# EAGLE schematic heartEM (EAGLE 9.6.2)
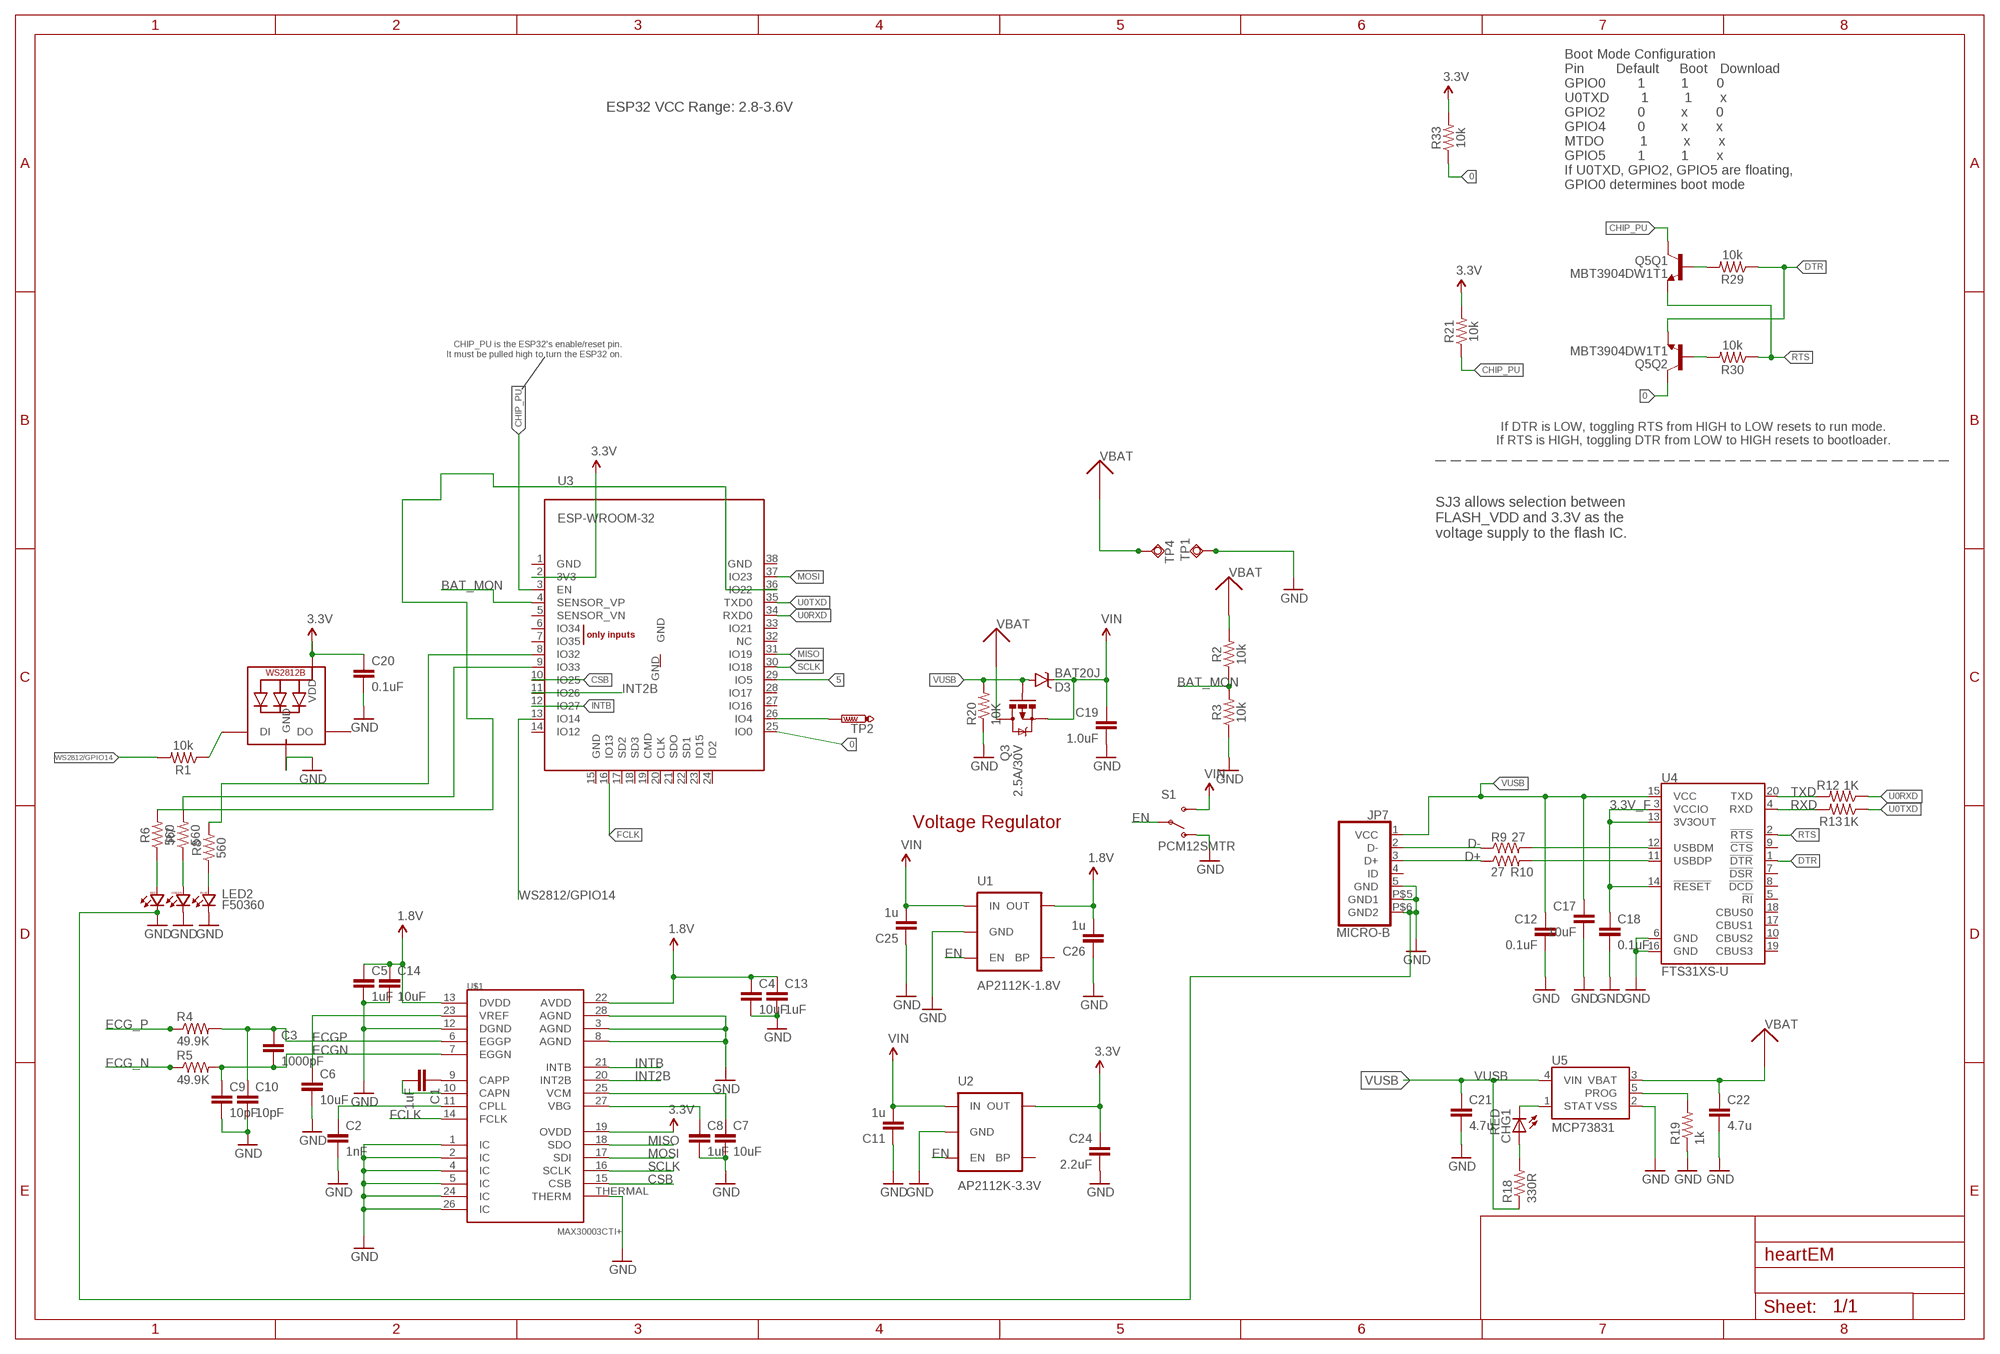
[diagram p0: schematic, sheet 1]

## Parts
C1  1uF  C-EUC0603  [C0603]
C2  1nF  C-EUC0603  [C0603]
C3  1000pF  C-EUC0402  [C0402]
C4  10uF  C-EUC0805  [C0805]
C5  1uF  C-EUC0402  [C0402]
C6  10uF  C-EUC0805  [C0805]
C7  10uF  C-EUC0805  [C0805]
C8  1uF  C-EUC0805  [C0805]
C9  10pF  C-EUC0402  [C0402]
C10  10pF  C-EUC0402  [C0402]
C11  1u  C-EUC0402  [C0402]
C12  0.1uF  C-EUC0402  [C0402]
C13  1uF  C-EUC0805  [C0805]
C14  10uF  C-EUC0603  [C0603]
C17  10uF  C-EUC0805  [C0805]
C18  0.1uF  C-EUC0402  [C0402]
C19  1.0uF  C-EUC0402  [C0402]
C20  0.1uF  0.1UF-0603-25V-(+80/-20%)  [0603]
C21  4.7u  C-EUC0805  [C0805]
C22  4.7u  C-EUC0805  [C0805]
C24  2.2uF  C-EUC0603  [C0603]
C25  1u  C-EUC0402  [C0402]
C26  1u  C-EUC0402  [C0402]
CHG1  RED  LEDCHIPLED_0603  [CHIPLED_0603]
D3  BAT20J  DIODE-SCHOTTKY-BAT20J  [SOD-323]
JP7  MICRO-B  [MICRO-B]
LED1  WS2812B5050  [WS2812B]
LED2  F50360  [F50360]
Q3  2.5A/30V  MOSFET-PCHANNELDMG2307L  [SOT23-3]
Q5  MBT3904DW1T1  [SC70-6]
R1  10k  10KOHM-1/10W-1%(0603)0603  [0603]
R2  10k  10KOHM-1/10W-1%(0603)0603  [0603]
R3  10k  10KOHM-1/10W-1%(0603)0603  [0603]
R4  49.9K  RESISTOR0805-RES  [0805]
R5  49.9K  RESISTOR0805-RES  [0805]
R6  560  10KOHM-1/10W-1%(0603)0603  [0603]
R7  560  10KOHM-1/10W-1%(0603)0603  [0603]
R8  560  10KOHM-1/10W-1%(0603)0603  [0603]
R9  27  R-US_R0402  [R0402]
R10  27  R-US_R0402  [R0402]
R12  1K  R-US_R0402  [R0402]
R13  1K  R-US_R0402  [R0402]
R18  330R  R-US_R0402  [R0402]
R19  1k  R-US_R0402  [R0402]
R20  10K  R-US_R0402  [R0402]
R21  10k  10KOHM-1/10W-1%(0603)0603  [0603]
R29  10k  10KOHM-0603-1/10W-1%  [0603]
R30  10k  10KOHM-0603-1/10W-1%  [0603]
R33  10k  10KOHM-1/10W-1%(0603)0603  [0603]
S1  PCM12SMTR  SWITCH-SPDT-SMD-A  [SWITCH-SPST-SMD-A]
TP1  TPSQTP20SQ  [TP20SQ]
TP2  PTR1TP10SQ  [TP10SQ]
TP4  TPSQTP20SQ  [TP20SQ]
U1  AP2112K-1.8V  V_REG_LDOSMD  [SOT23-5]
U2  AP2112K-3.3V  V_REG_LDOSMD  [SOT23-5]
U3  ESP-WROOM-32  [ESP-WROOM-32]
U4  FTS31XS-U  FT231XS  [SSOP20_L]
U5  MCP73831  [SOT23-5]
U$1  MAX30003CTI+  MAX30003  [QFN-28]

## Nets
0: Q5.6(Q2:C) R33.1 U3.25(IO0)
1.8V: C4.1 C5.1 C13.1 C14.1 C26.2 U1.5(OUT) U$1.13(DVDD) U$1.22(AVDD)
3.3V: C20.1 C24.1 LED1.1-VDD(VDD) R21.2 R33.2 U2.5(OUT) U3.2(3V3) U$1.19(OVDD)
3.3V_F: C18.1 U4.3(VCCIO) U4.13(3V3OUT) U4.14(!RESET)
5: U3.29(IO5)
BAT_MON: R2.1 R3.2 U3.4(SENSOR_VP)
CHIP_PU: Q5.3(Q1:C) R21.1 U3.3(EN)
CSB: U3.10(IO25) U$1.15(CSB)
D+: JP7.3(D+) R10.1
D-: JP7.2(D-) R9.1
DTR: Q5.1(Q2:E) R29.1 U4.1(!DTR)
ECG_N: R5.1
ECG_P: R4.1
ECGN: C3.2 C9.1 R5.2 U$1.7(EGGN)
ECGP: C3.1 C10.1 R4.2 U$1.6(EGGP)
EN: S1.2(P) U1.3(EN) U2.3(EN)
FCLK: U3.16(IO13) U$1.14(FCLK)
GND: C2.2 C4.2 C5.2 C6.2 C7.2 C8.2 C9.2 C10.2 C11.1 C12.2 C13.2 C14.2 C17.2 C18.2 C19.2 C20.2 C21.2 C22.2 C24.2 C25.1 C26.1 JP7.5(GND) JP7.P$5(GND1) JP7.P$6(GND2) LED1.3-GND(GND) LED2.BC LED2.GC LED2.RC R3.1 R19.1 R20.1 S1.1(O) TP1.TP U1.2(GND) U2.2(GND) U4.6(GND) U4.16(GND) U5.2(VSS) U$1.1(IC) U$1.2(IC) U$1.3(AGND) U$1.4(IC) U$1.5(IC) U$1.8(AGND) U$1.12(DGND) U$1.24(IC) U$1.26(IC) U$1.28(AGND) U$1.THERMAL(THERM)
INT2B: U3.11(IO26) U$1.20(INT2B)
INTB: U3.12(IO27) U$1.21(INTB)
MISO: U3.31(IO19) U$1.18(SDO)
MOSI: U3.37(IO23) U$1.17(SDI)
N$1: LED1.4-DIN(DI) R1.1
N$2: C6.1 U$1.23(VREF)
N$3: C1.1 U$1.9(CAPP)
N$4: TP2.TP U3.26(IO4)
N$5: CHG1.C U5.1(STAT)
N$6: C1.2 U$1.10(CAPN)
N$7: C2.1 U$1.11(CPLL)
N$9: R9.2 U4.12(USBDM)
N$10: LED2.RA R6.1
N$11: R10.2 U4.11(USBDP)
N$12: R7.2 U3.9(IO33)
N$13: C7.1 U$1.25(VCM)
N$14: C8.1 U$1.27(VBG)
N$15: LED2.BA R8.1
N$16: CHG1.A R18.2
N$17: LED2.GA R7.1
N$19: R19.2 U5.5(PROG)
N$20: R8.2 U3.8(IO32)
N$22: R6.2 U3.36(IO22)
N$23: Q5.5(Q1:B) R29.2
N$24: Q5.2(Q2:B) R30.2
RTS: Q5.4(Q1:E) R30.1 U4.2(!RTS)
RXD: R13.2 U4.4(RXD)
SCLK: U3.30(IO18) U$1.16(SCLK)
TXD: R12.2 U4.20(TXD)
U0RXD: R12.1 U3.34(RXD0)
U0TXD: R13.1 U3.35(TXD0)
VBAT: C22.1 Q3.3(D) R2.2 TP4.TP U5.3(VBAT)
VIN: C11.2 C19.1 C25.2 D3.C Q3.2(S) S1.3(S) U1.1(IN) U2.1(IN)
VUSB: C12.1 C17.1 C21.1 D3.A JP7.1(VCC) Q3.1(G) R18.1 R20.2 U4.15(VCC) U5.4(VIN)
WS2812/GPIO14: R1.2 U3.13(IO14)
Unconnected: JP7.4(ID) LED1.2-DOUT(DO) U1.4(BP) U2.4(BP) U3.1(GND) U3.5(SENSOR_VN) U3.6(IO34) U3.7(IO35) U3.14(IO12) U3.15(GND) U3.17(SD2) U3.18(SD3) U3.19(CMD) U3.20(CLK) U3.21(SDO) U3.22(SD1) U3.23(IO15) U3.24(IO2) U3.27(IO16) U3.28(IO17) U3.32(NC) U3.33(IO21) U3.38(GND) U3.GND U4.5(!RI) U4.7(!DSR) U4.8(!DCD) U4.9(!CTS) U4.10(CBUS2) U4.17(CBUS1) U4.18(CBUS0) U4.19(CBUS3)

## Notes on the sheet
- ESP32 VCC Range: 2.8-3.6V
- Boot Mode Configuration
  Pin        Default     Boot   Download
  GPIO0        1         1       0
  U0TXD        1         1       x
  GPIO2        0         x       0
  GPIO4        0         x       x
  MTDO         1         x       x
  GPIO5        1         1       x
  If U0TXD, GPIO2, GPIO5 are floating, 
  GPIO0 determines boot mode
- CHIP_PU is the ESP32's enable/reset pin.
  It must be pulled high to turn the ESP32 on.
- If DTR is LOW, toggling RTS from HIGH to LOW resets to run mode.
  If RTS is HIGH, toggling DTR from LOW to HIGH resets to bootloader.
- SJ3 allows selection between 
  FLASH_VDD and 3.3V as the
  voltage supply to the flash IC.
- Voltage Regulator

## Library data of the parts
C1-C14 C17-C19 C21 C22 C24-C26 = rcl:C-EU: CAPACITOR, European symbol; SPICEPREFIX: C
C20 = SparkFun-Capacitors:0.1UF: 0.1µF ceramic capacitors A capacitor is a passive two-terminal electrical component used to store electrical energy temporarily in an electric field.; PROD_ID: CAP-00810
CHG1 = led:LED: LED OSRAM: - CHIPLED LG R971, LG N971, LY N971, LG Q971, LY Q971, LO R971, LY R971 LH N974, LH R974 LS Q976, LO Q976, LY Q976 LO Q996 - Hyper CHIPLED LW Q18S LB Q993, LB Q99A, LB R99A - SideLED LS A670, LO A670, LY A670, LG A670, LP A670 LB A673, LV A673, LT A673, LW A673 LH A674 LY A675 LS A676, LA A676, LO A676, LY A676, LW A676 LS A679, LY A679, LG A679 - Hyper Micro SIDELED® LS Y876, LA Y876, LO Y876, LY Y876 LT Y87S - SmartLED LW L88C, LW L88S LB L89C, LB L89S, LG L890 LS L89K, LO L89K, LY L89K LS L896, LA L896, LO L896, LY L896 - TOPLED LS T670, LO T670, LY T670, LG T670, LP T670 LSG T670, LSP T670, LSY T670, LOP T670, LYG T670 LG T671, LOG T671, LSG T671 LB T673, LV T673, LT T673, LW T673 LH T674 LS T676, LA T676, LO T676, LY T676, LB T676, LH T676, LSB T676, LW T676 LB T67C, LV T67C, LT T67C, LS T67K, LO T67K, LY T67K, LW E67C LS E67B, LA E67B, LO E67B, LY E67B, LB E67C, LV E67C, LT E67C LW T67C LS T679, LY T679, LG T679 LS T770, LO T770, LY T770, LG T770, LP T770 LB T773, LV T773, LT T773, LW T773 LH T774 LS E675, LA E675, LY E675, LS T675 LS T776, LA T776, LO T776, LY T776, LB T776 LHGB T686 LT T68C, LB T68C - Hyper Mini TOPLED® LB M676 - Mini TOPLED Santana® LG M470 LS M47K, LO M47K, LY M47K Source: http://www.osram.convergy.de LUXEON: - LUMILED® LXK2-PW12-R00, LXK2-PW12-S00, LXK2-PW14-U00, LXK2-PW14-V00 LXK2-PM12-R00, LXK2-PM12-S00, LXK2-PM14-U00 LXK2-PE12-Q00, LXK2-PE12-R00, LXK2-PE12-S00, LXK2-PE14-T00, LXK2-PE14-U00 LXK2-PB12-K00, LXK2-PB12-L00, LXK2-PB12-M00, LXK2-PB14-N00, LXK2-PB14-P00, LXK2-PB14-Q00 LXK2-PR12-L00, LXK2-PR12-M00, LXK2-PR14-Q00, LXK2-PR14-R00 LXK2-PD12-Q00, LXK2-PD12-R00, LXK2-PD12-S00 LXK2-PH12-R00, LXK2-PH12-S00 LXK2-PL12-P00, LXK2-PL12-Q00, LXK2-PL12-R00 Source: www.luxeon.com KINGBRIGHT: KA-3528ASYC Source: www.kingbright.com
D3 = SparkFun-DiscreteSemi:DIODE-SCHOTTKY: Schottky diodes in SFE's production catalog BAT20J 1A 23V 0.62Vf RB751 120mA 40V 0.37Vf PMEG4005EJ 0.5A 40V 0.42Vf MBRA140 1A 40V 0.5Vf B340A 3A 40V SMA; PROD_ID: DIO-11623
JP7 = circuitects:MICRO-B
LED1 = adafruit:WS2812B
LED2 = led:F50360: Full color Z-Power LED RGB P5-II Series Source: http://www.seoulsemicon.co.kr .. F50360.pdf
Q3 = SparkFun-DiscreteSemi:MOSFET-PCHANNEL: Generic PMOSFET IRLML2244 - TRANS-11153 (SOT-23 -20V -4.3A) (1.Gate 2.Source 3.Drain) FQP27P06 - COM-10349 <http://www.sparkfun.com/products/10349> (TO-220 -60V -27A) (1.Gate 2.Source 3.Drain); PROD_ID: TRANS-11308
Q5 = esp32-thing-temp:MBT3904DW1T1: MBT3904DW1 Dual NPN Transistors The MBT3904W1 puts two general purpose 3904 NPN transistors in a single package. Datasheet <http://www.onsemi.com/pub_link/Collateral/MBT3904DW1T1-D.PDF>; PROD_ID: TRANS-13337
R1-R3 R6-R8 R21 R33 = SparkFun-Resistors:10KOHM-1/10W-1%(0603): RES-00824; PROD_ID: RES-00824; VALUE: 10K
R4 R5 = SparkFun:RESISTOR: Resistor Basic schematic elements and footprints for 0603, 1206, and PTH resistors.
R9 R10 R12 R13 R18-R20 = rcl:R-US_: RESISTOR, American symbol; SPICEPREFIX: R
R29 R30 = SparkFun-Resistors:10KOHM: 10kΩ resistor A resistor is a passive two-terminal electrical component that implements electrical resistance as a circuit element. Resistors act to reduce current flow, and, at the same time, act to lower voltage levels within circuits. - Wikipedia; PROD_ID: RES-00824
S1 = SparkFun-Electromechanical:SWITCH-SPDT: SPDT Switch Simple slide switch, Spark Fun Electronics SKU : COM-00102 DPDT SMT slide switch, AYZ0202, SWCH-08179; PROD_ID: SWCH-10651
TP1 TP4 = testpad:TPSQ: Test pad
TP2 = testpad:PTR1: TEST PIN
U1 U2 = SparkFun-PowerIC:V_REG_LDO: Voltage Regulator LDO Standard 150mA LDO voltage regulator in SOT-23 layout. Micrel part MIC5205. BP (by-pass) pin is used to lower output noise with 470pF cap.; PROD_ID: VREG-12457
U3 = esp32:ESP-WROOM-32; SPICEPREFIX: X
U4 = SparkFun-DigitalIC:FT231X: FTDI FT231X Full Speed USB to Full-handshake UART This USB2.0 Full Speed IC offers a compact bridge to full handshake UART interfaces. The device is a UART, capable of operating up to 3MBaud, with low power consumption (8mA). The FT231X includes the complete FT-X series feature set and enables USB to be added into a system design quickly and easily over a UART interface.; PROD_ID: IC-11524; VALUE: FT231XS
U5 = SparkFun:MCP73831: Microchip's MCP73831 Miniature single cell, fully integrated Li-Ion, Li-polymer charge management controller http://ww1.microchip.com/downloads/en/DeviceDoc/21984a.pdf
U$1 = circuitects:MAX30003